# EAGLE design PulseInOut (EAGLE 6.2)
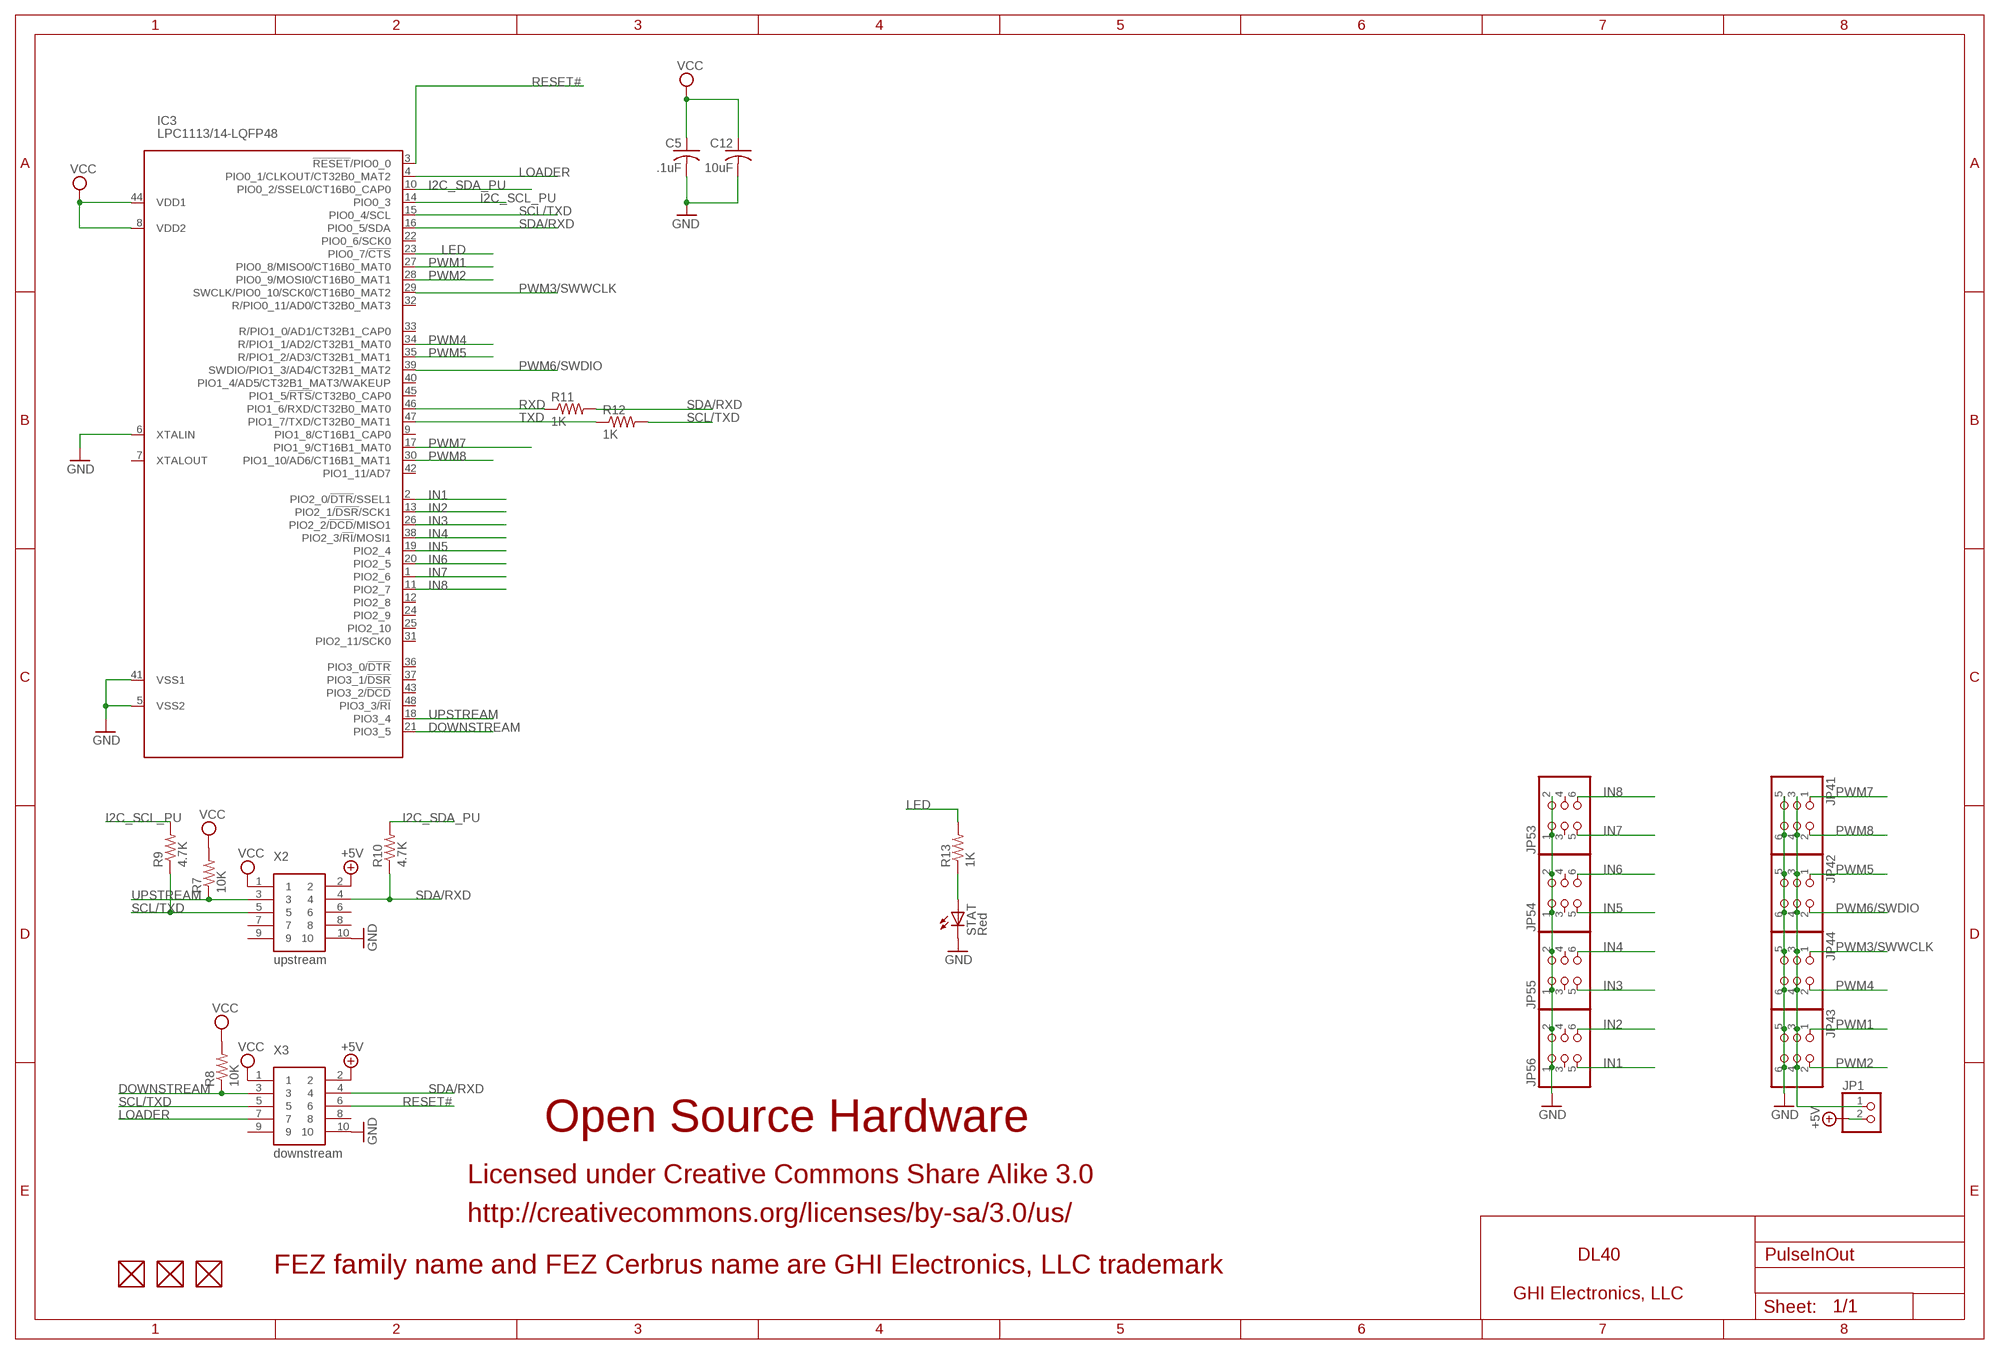
[diagram p0: schematic, sheet 1]

## Parts
C5  .1uF  C-USC0603K  [C0603K]
C12  10uF  C-USC0805K  [C0805K]
FUD4  FIDUCIAL  [FIDUCIAL_40MIL]
FUD5  FIDUCIAL  [FIDUCIAL_40MIL]
FUD6  FIDUCIAL  [FIDUCIAL_40MIL]
IC3  LPC1113/14-LQFP48  [LQFP48]
JP1  PINHD-1X2  [1X02]
JP41  PINHD-2X3  [2X03]
JP42  PINHD-2X3  [2X03]
JP43  PINHD-2X3  [2X03]
JP44  PINHD-2X3  [2X03]
JP53  PINHD-2X3  [2X03]
JP54  PINHD-2X3  [2X03]
JP55  PINHD-2X3  [2X03]
JP56  PINHD-2X3  [2X03]
R7  10K  R-US_R0603  [R0603]
R8  10K  R-US_R0603  [R0603]
R9  4.7K  R-US_R0603  [R0603]
R10  4.7K  R-US_R0603  [R0603]
R11  1K  R-US_R0603  [R0603]
R12  1K  R-US_R0603  [R0603]
R13  1K  R-US_R0603  [R0603]
STAT  Red  LEDCHIPLED_0805  [CHIPLED_0805]
X2  upstream  2X5_1.27MM  [2X5_1.27MM]
X3  downstream  2X5_1.27MM  [2X5_1.27MM]

## Nets
+5V: JP1.2 X2.2 X3.2
DOWNSTREAM: IC3.21(PIO3_5) R8.1 X3.3
GND [power]: C5.2 C12.2 IC3.5(VSS2) IC3.6(XTALIN) IC3.41(VSS1) JP41.5 JP41.6 JP42.5 JP42.6 JP43.5 JP43.6 JP44.5 JP44.6 JP53.1 JP53.2 JP54.1 JP54.2 JP55.1 JP55.2 JP56.1 JP56.2 STAT.C X2.10 X3.10
I2C_SCL_PU: IC3.14(PIO0_3) R9.2
I2C_SDA_PU: IC3.10(PIO0_2/SSEL0/CT16B0_CAP0) R10.2
IN1: IC3.2(PIO2_0/!DTR!/SSEL1) JP56.5
IN2: IC3.13(PIO2_1/!DSR!/SCK1) JP56.6
IN3: IC3.26(PIO2_2/!DCD!/MISO1) JP55.5
IN4: IC3.38(PIO2_3/!RI!/MOSI1) JP55.6
IN5: IC3.19(PIO2_4) JP54.5
IN6: IC3.20(PIO2_5) JP54.6
IN7: IC3.1(PIO2_6) JP53.5
IN8: IC3.11(PIO2_7) JP53.6
LED: IC3.23(PIO0_7/!CTS!) R13.2
LOADER: IC3.4(PIO0_1/CLKOUT/CT32B0_MAT2) X3.7
N$3: JP1.1 JP41.3 JP41.4 JP42.3 JP42.4 JP43.3 JP43.4 JP44.3 JP44.4
N$10: R13.1 STAT.A
PWM1: IC3.27(PIO0_8/MISO0/CT16B0_MAT0) JP43.1
PWM2: IC3.28(PIO0_9/MOSI0/CT16B0_MAT1) JP43.2
PWM3/SWWCLK: IC3.29(SWCLK/PIO0_10/SCK0/CT16B0_MAT2) JP44.1
PWM4: IC3.34(R/PIO1_1/AD2/CT32B1_MAT0) JP44.2
PWM5: IC3.35(R/PIO1_2/AD3/CT32B1_MAT1) JP42.1
PWM6/SWDIO: IC3.39(SWDIO/PIO1_3/AD4/CT32B1_MAT2) JP42.2
PWM7: IC3.17(PIO1_9/CT16B1_MAT0) JP41.1
PWM8: IC3.30(PIO1_10/AD6/CT16B1_MAT1) JP41.2
RESET#: IC3.3(!RESET!/PIO0_0) X3.6
RXD: IC3.46(PIO1_6/RXD/CT32B0_MAT0) R11.1
SCL/TXD: IC3.15(PIO0_4/SCL) R9.1 R12.2 X2.5 X3.5
SDA/RXD: IC3.16(PIO0_5/SDA) R10.1 R11.2 X2.4 X3.4
TXD: IC3.47(PIO1_7/TXD/CT32B0_MAT1) R12.1
UPSTREAM: IC3.18(PIO3_4) R7.1 X2.3
VCC [power]: C5.1 C12.1 IC3.8(VDD2) IC3.44(VDD1) R7.2 R8.2 X2.1 X3.1
Unconnected: FUD4.P$1 FUD5.P$1 FUD6.P$1 IC3.7(XTALOUT) IC3.9(PIO1_8/CT16B1_CAP0) IC3.12(PIO2_8) IC3.22(PIO0_6/SCK0) IC3.24(PIO2_9) IC3.25(PIO2_10) IC3.31(PIO2_11/SCK0) IC3.32(R/PIO0_11/AD0/CT32B0_MAT3) IC3.33(R/PIO1_0/AD1/CT32B1_CAP0) IC3.36(PIO3_0/!DTR!) IC3.37(PIO3_1/!DSR!) IC3.40(PIO1_4/AD5/CT32B1_MAT3/WAKEUP) IC3.42(PIO1_11/AD7) IC3.43(PIO3_2/!DCD!) IC3.45(PIO1_5/!RTS!/CT32B0_CAP0) IC3.48(PIO3_3/!RI!) JP53.3 JP53.4 JP54.3 JP54.4 JP55.3 JP55.4 JP56.3 JP56.4 X2.6 X2.7 X2.8 X2.9 X3.8 X3.9

## Notes on the sheet
- Open Source Hardware
- Licensed under Creative Commons Share Alike 3.0
- http://creativecommons.org/licenses/by-sa/3.0/us/
- DL40
- FEZ family name and FEZ Cerbrus name are GHI Electronics, LLC trademark
- GHI Electronics, LLC

## Library data of the parts
C5 C12 = rcl:C-US: CAPACITOR, American symbol
FUD4-FUD6 = GHI:FIDUCIAL
IC3 = lpc1100v1.1:LPC1113/14-LQFP48: NXP Semiconductors LPC11xx microcontrollers <http://ics.nxp.com/products/lpc1000/lpc11xx/> ARM 32-bit Cortex-M0 Microcontroller with MPU CPU clock up to 50MHz Up to 32KByte on-chip Flash ROM with In-System Programming (ISP) and In-Application Programming (IAP) via On-Chip Bootloader Up to 8KByte SRAM Nested Vectored Interrupt Controller Up to 2 SPI controllers UART with full Modem Interface and RS485 Support Fast Mode I2C-Bus 4 Timers with 4 capture channels and 13 output channels Watchdog (WDT) Sytem tick timer 10-bit ADC with 8 channels Power Management Unit (PMU) Brownout detection 12MHz internal RC oscillator Serial Wire Debug/Trace port
JP1 = pinhead:PINHD-1X2: PIN HEADER
JP41-JP44 JP53-JP56 = pinhead:PINHD-2X3: PIN HEADER
R7-R13 = rcl:R-US_: RESISTOR, American symbol
STAT = led:LED: LED OSRAM: - CHIPLED LG R971, LG N971, LY N971, LG Q971, LY Q971, LO R971, LY R971 LH N974, LH R974 LS Q976, LO Q976, LY Q976 LO Q996 - Hyper CHIPLED LW Q18S LB Q993, LB Q99A, LB R99A - SideLED LS A670, LO A670, LY A670, LG A670, LP A670 LB A673, LV A673, LT A673, LW A673 LH A674 LY A675 LS A676, LA A676, LO A676, LY A676, LW A676 LS A679, LY A679, LG A679 - Hyper Micro SIDELED® LS Y876, LA Y876, LO Y876, LY Y876 LT Y87S - SmartLED LW L88C, LW L88S LB L89C, LB L89S, LG L890 LS L89K, LO L89K, LY L89K LS L896, LA L896, LO L896, LY L896 - TOPLED LS T670, LO T670, LY T670, LG T670, LP T670 LSG T670, LSP T670, LSY T670, LOP T670, LYG T670 LG T671, LOG T671, LSG T671 LB T673, LV T673, LT T673, LW T673 LH T674 LS T676, LA T676, LO T676, LY T676, LB T676, LH T676, LSB T676, LW T676 LB T67C, LV T67C, LT T67C, LS T67K, LO T67K, LY T67K, LW E67C LS E67B, LA E67B, LO E67B, LY E67B, LB E67C, LV E67C, LT E67C LW T67C LS T679, LY T679, LG T679 LS T770, LO T770, LY T770, LG T770, LP T770 LB T773, LV T773, LT T773, LW T773 LH T774 LS E675, LA E675, LY E675, LS T675 LS T776, LA T776, LO T776, LY T776, LB T776 LHGB T686 LT T68C, LB T68C - Hyper Mini TOPLED® LB M676 - Mini TOPLED Santana® LG M470 LS M47K, LO M47K, LY M47K Source: http://www.osram.convergy.de LUXEON: - LUMILED® LXK2-PW12-R00, LXK2-PW12-S00, LXK2-PW14-U00, LXK2-PW14-V00 LXK2-PM12-R00, LXK2-PM12-S00, LXK2-PM14-U00 LXK2-PE12-Q00, LXK2-PE12-R00, LXK2-PE12-S00, LXK2-PE14-T00, LXK2-PE14-U00 LXK2-PB12-K00, LXK2-PB12-L00, LXK2-PB12-M00, LXK2-PB14-N00, LXK2-PB14-P00, LXK2-PB14-Q00 LXK2-PR12-L00, LXK2-PR12-M00, LXK2-PR14-Q00, LXK2-PR14-R00 LXK2-PD12-Q00, LXK2-PD12-R00, LXK2-PD12-S00 LXK2-PH12-R00, LXK2-PH12-S00 LXK2-PL12-P00, LXK2-PL12-Q00, LXK2-PL12-R00 Source: www.luxeon.com KINGBRIGHT: KA-3528ASYC Source: www.kingbright.com
X2 X3 = GHI:2X5_1.27MM

## Board
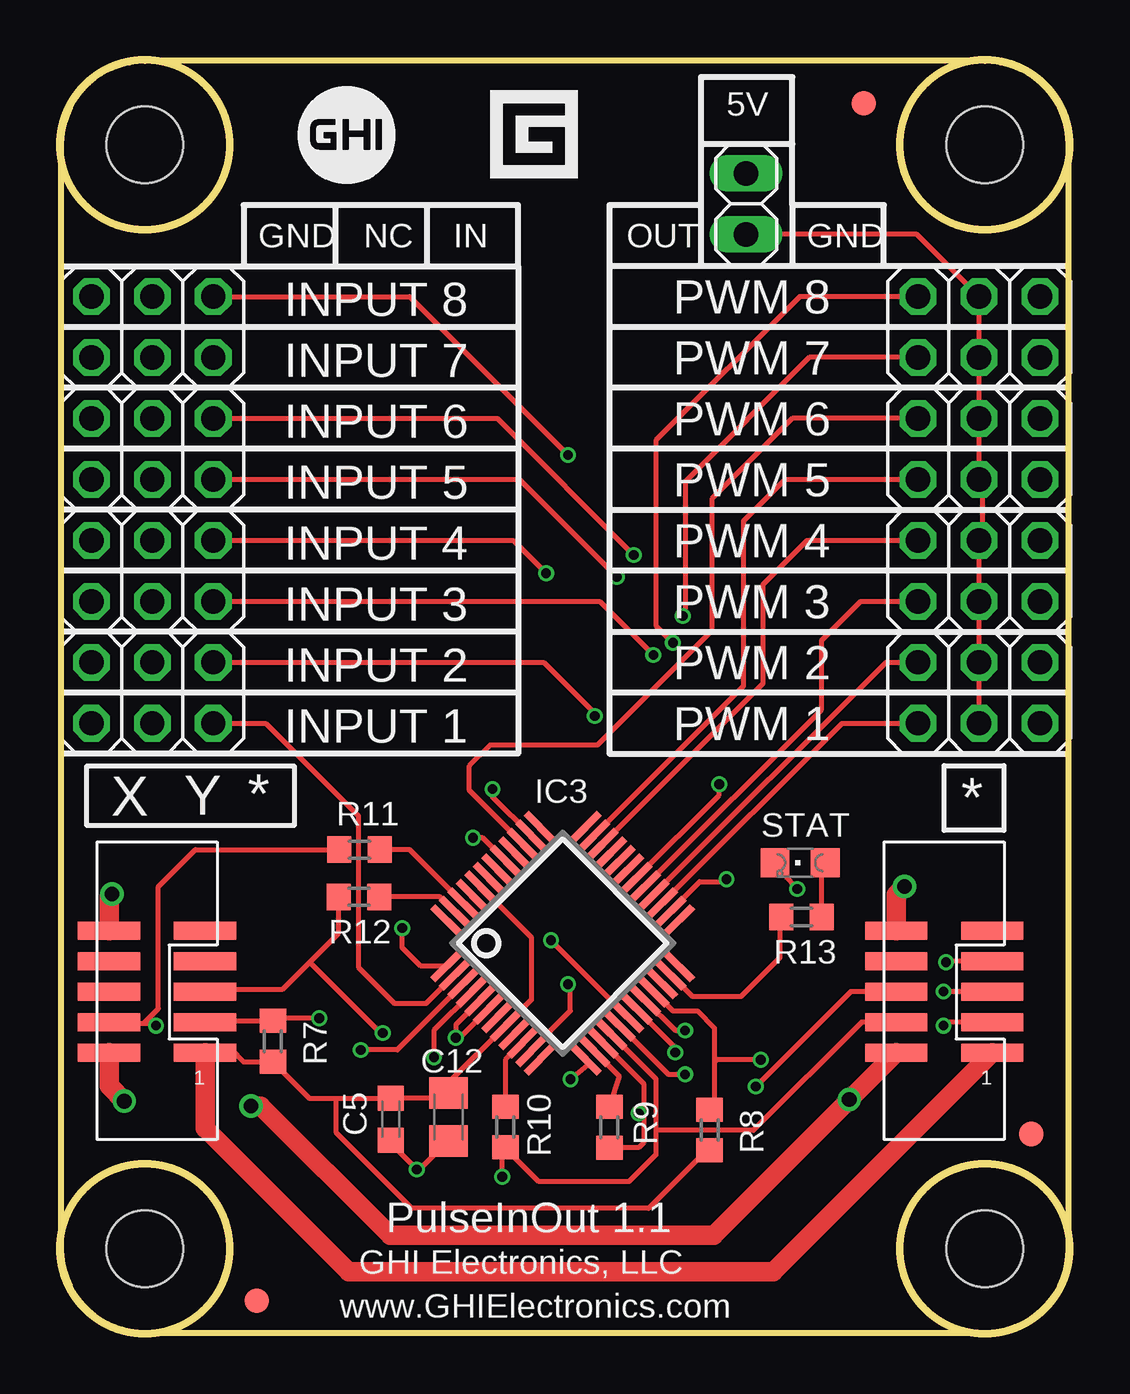
[diagram p1: board, top side]
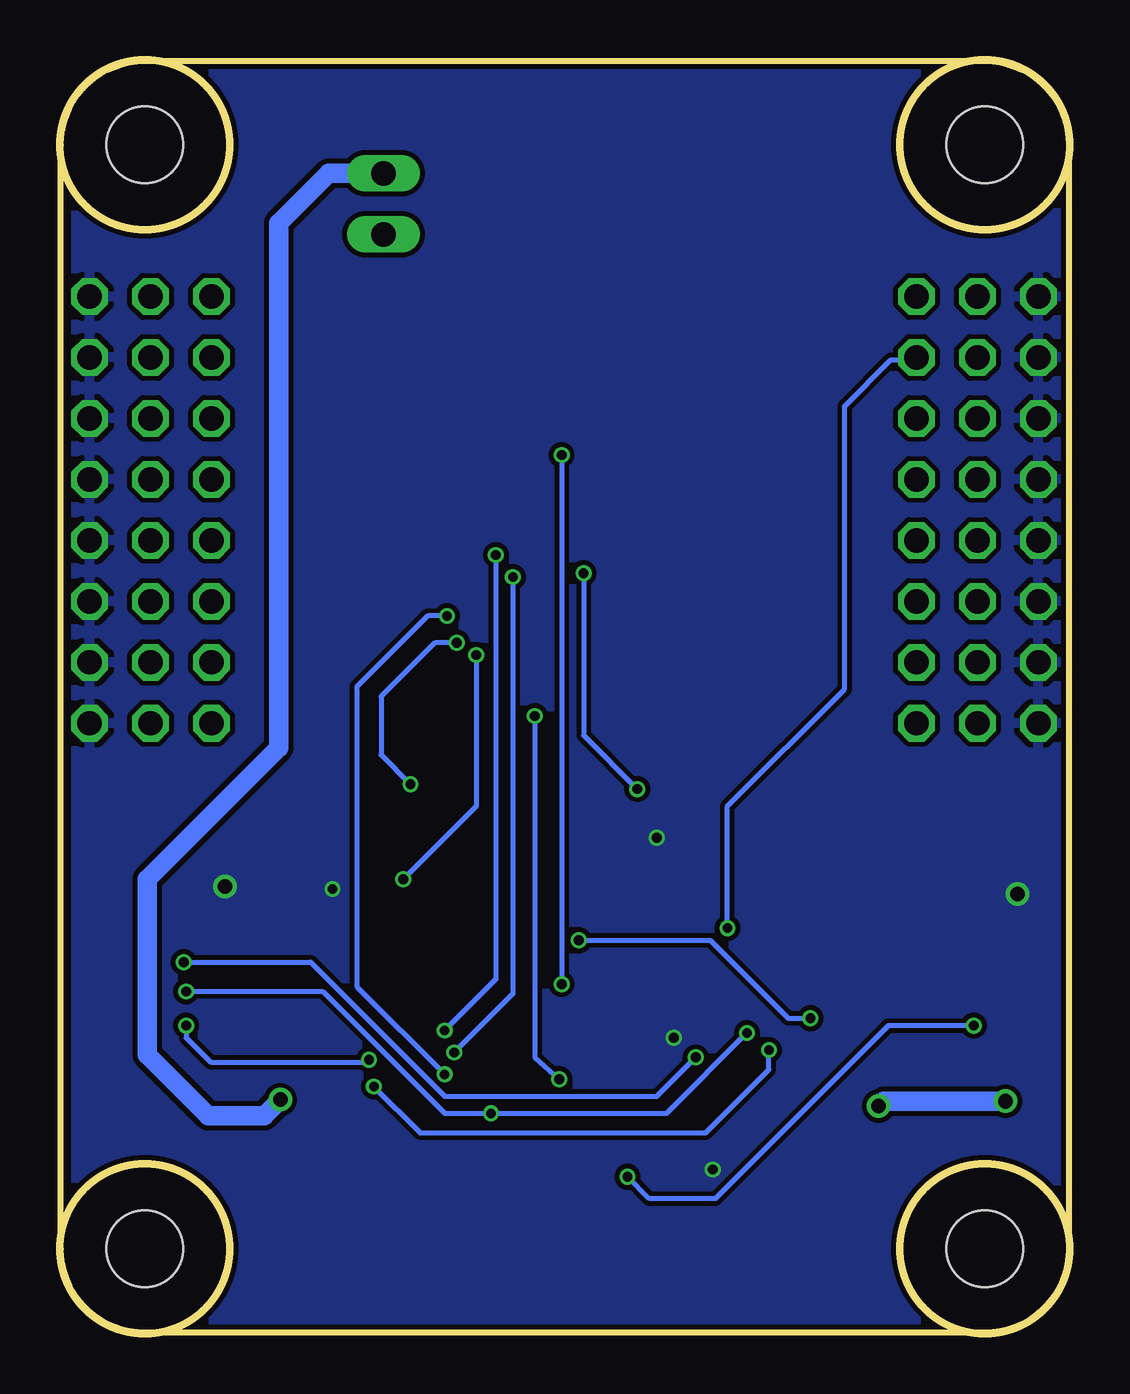
[diagram p2: board, bottom side, seen from below]

Size 42.07 x 53.07 mm. Coordinates in mm from the lower left corner, seen from the top.
Outline: 38.54,0.04 arc90 42.04,3.54 42.04,49.54 arc90 38.54,53.04 3.54,53.04 arc90 0.04,49.54 0.04,3.54 arc90 3.54,0.04 38.54,0.04
Outline: circle at 38.54,3.54 radius 3.54
Outline: circle at 3.54,3.54 radius 3.54
Outline: circle at 3.54,49.54 radius 3.54
Outline: circle at 38.54,49.54 radius 3.54
Copper layers (1+16): Top 0.035mm / dielectric 1.5mm / Bottom 0.035mm
Design rules: minimum track width 6mil, minimum drill 10mil, track to track 8mil, track to pad 8mil, pad to pad 7.5mil, via to via 8mil, smd to smd 7.5mil, copper to edge 8mil, drill to drill 8mil, minimum pad ring 10mil, minimum via ring 5mil, stop-mask expansion 4mil, vias tented up to drill 50mil, thermal gap 10mil
Holes 3.2 mm at 3.54,3.54 38.54,3.54 3.54,49.54 38.54,49.54

### Footprints (pad centres in the part's own frame; a part is rotated, then mirrored left to right if it is on the bottom)
C0603K = smd 1.05 x 1.08: 1 -0.875,0; 2 0.875,0
C0805K = smd 1.3 x 1.6: 1 -1,0; 2 1,0
FIDUCIAL_40MIL = smd 1.016 x 1.016: P$1 0,0
LQFP48 = smd 0.3 x 1.6: 1 -2.75,-4.1; 2 -2.25,-4.1; 3 -1.75,-4.1; 4 -1.25,-4.1; 5 -0.75,-4.1; 6 -0.25,-4.1; 7 0.25,-4.1; 8 0.75,-4.1; 9 1.25,-4.1; 10 1.75,-4.1; 11 2.25,-4.1; 12 2.75,-4.1; 25 2.75,4.1; 26 2.25,4.1; 27 1.75,4.1; 28 1.25,4.1; 29 0.75,4.1; 30 0.25,4.1; 31 -0.25,4.1; 32 -0.75,4.1; 33 -1.25,4.1; 34 -1.75,4.1; 35 -2.25,4.1; 36 -2.75,4.1 | smd 1.6 x 0.3: 13 4.1,-2.75; 14 4.1,-2.25; 15 4.1,-1.75; 16 4.1,-1.25; 17 4.1,-0.75; 18 4.1,-0.25; 19 4.1,0.25; 20 4.1,0.75; 21 4.1,1.25; 22 4.1,1.75; 23 4.1,2.25; 24 4.1,2.75; 37 -4.1,2.75; 38 -4.1,2.25; 39 -4.1,1.75; 40 -4.1,1.25; 41 -4.1,0.75; 42 -4.1,0.25; 43 -4.1,-0.25; 44 -4.1,-0.75; 45 -4.1,-1.25; 46 -4.1,-1.75; 47 -4.1,-2.25; 48 -4.1,-2.75
1X02 = drill 1.016 long: 1 -1.27,0; 2 1.27,0
2X03 = drill 1.016 octagon: 1 -2.54,-1.27; 2 -2.54,1.27; 3 0,-1.27; 4 0,1.27; 5 2.54,-1.27; 6 2.54,1.27
R0603 = smd 1 x 1.1: 1 -0.85,0; 2 0.85,0
CHIPLED_0805 = smd 1.2 x 1.2: A 0,-1.05; C 0,1.05
2X5_1.27MM = smd 2.6 x 0.74: 1 -2,2.58; 2 2,2.58; 3 -2,1.31; 4 2,1.31; 5 -2,0.04; 6 2,0.04; 7 -2,-1.23; 8 2,-1.23; 9 -2,-2.5; 10 2,-2.5

### Placement (x,y rotation side)
C5  13.78,8.93 270 top
C12  16.18,9.03 270 top
FUD4  40.47,8.32 0 top
FUD5  33.49,51.27 0 top
FUD6  8.19,1.38 0 top
IC3  20.94,16.27 315 top
JP1  28.59,47.08 90 top
JP41  38.3,41.95 0 top
JP42  38.3,36.87 0 top
JP43  38.3,26.71 0 top
JP44  38.3,31.79 0 top
JP53  3.85,41.95 0 top
JP54  3.85,36.87 0 top
JP55  3.85,31.79 0 top
JP56  3.85,26.71 0 top
R7  8.87,12.18 270 top
R8  27.07,8.49 270 top
R9  22.89,8.6 90 top
R10  18.56,8.62 90 top
R11  12.48,20.17 180 top
R12  12.46,18.2 180 top
R13  30.9,17.36 180 top
STAT  30.84,19.62 90 top
X2  4.04,14.29 180 top
X3  36.84,14.29 180 top

### Tracks (layer width: path | path; a pad name or v marks a point on that pad's centre or on a via)
+5V  (via drill 0.61)
  Top 0.813: X3.2 v32.89,9.75 27.23,4.1 13.75,4.1 8.37,9.48 v7.96,9.48 | v2.68,9.69 2.04,10.32 X2.2
  Bottom 0.813: v7.96,9.48 7.76,9.69 v2.68,9.69 | JP1.2 30.87,48.35 32.95,46.26 32.95,24.42 38.44,18.93 38.44,11.62 35.9,9.08 33.56,9.08 v32.89,9.75
DOWNSTREAM  (via drill 0.41)
  Top 0.203: IC3.21 25.54,13.45 26.55,13.45 27.26,12.74 27.26,11.31 | 27.26,11.31 27.26,9.54 R8.1 | X3.3 36.96,12.98 v36.81,12.84 | v29.19,11.41 27.37,11.41 27.26,11.31
  Bottom 0.203: v36.81,12.84 36.81,12.33 35.8,11.31 29.3,11.31 v29.19,11.41
GND  (via drill 0.41, 0.61)
  Top 0.203: IC3.41 17.61,20.66 v17.21,20.66 | IC3.6 16.65,12.33 v16.49,12.33 16.49,12.88 IC3.5 | C12.2 15,6.84 v14.87,6.84 13.78,7.93 C5.2 | STAT.C 29.79,19.56 v30.72,18.53
  Top 0.813: X2.10 2.04,18.2 v2.17,18.32 | X3.10 34.84,18.28 v35.19,18.63
  pour Bottom: 0.14,52.97 0.14,-0.37 41.39,-0.37 41.39,52.97
I2C_SCL_PU
  Top 0.203: IC3.14 23.3,10.73 R9.2
I2C_SDA_PU
  Top 0.203: IC3.10 18.56,11.41 R10.2
IN1
  Top 0.203: JP56.5 8.57,25.44 12.43,21.57 12.43,15.28 13.95,13.75 15.24,13.75 IC3.2
IN2  (via drill 0.41)
  Top 0.203: JP56.6 20.15,27.98 22.29,25.84 v22.29,25.74 | v21.27,10.6 21.98,11.21 21.98,11.34 IC3.13
  Bottom 0.203: v22.29,25.74 22.29,11.52 v21.27,10.6
IN3  (via drill 0.41)
  Top 0.203: IC3.26 25.43,17.61 26.65,18.83 27.67,18.83 v27.77,18.93 | JP55.5 22.49,30.52 v24.72,28.28
  Bottom 0.203: v24.72,28.28 24.72,21.98 v27.77,18.93
IN4  (via drill 0.41)
  Top 0.203: JP55.6 18.88,33.06 v20.25,31.68 | IC3.38 18.02,22.38 v18.02,22.69
  Bottom 0.203: v20.25,31.68 20.25,24.93 v18.02,22.69
IN5  (via drill 0.41)
  Top 0.203: JP54.5 19.14,35.6 v23.2,31.53 | IC3.19 25.64,11.92 v25.64,11.72
  Bottom 0.203: v23.2,31.53 23.2,14.16 v25.64,11.72
IN6  (via drill 0.41)
  Top 0.203: JP54.6 18.22,38.14 v23.91,32.45 | IC3.20 25.64,12.63 v26.05,12.63
  Bottom 0.203: v23.91,32.45 23.91,14.77 v26.05,12.63
IN7  (via drill 0.41)
  Top 0.203: IC3.1 15.03,15.31 14.26,16.09 v14.26,16.9
  Bottom 0.203: v14.26,16.9 14.26,21.98 9.38,26.86 9.38,38.64 7.45,40.57 6.49,40.57 JP53.5
IN8  (via drill 0.41)
  Top 0.203: JP53.6 14.56,43.22 v21.17,36.61 | IC3.11 19.64,11.81 21.27,13.45 21.27,14.46 v21.17,14.56
  Bottom 0.203: v21.17,36.61 v21.17,14.56
LED
  Top 0.203: IC3.23 26.35,14.06 28.38,14.06 30.01,15.68 30.01,17.32 R13.2
LOADER  (via drill 0.41)
  Top 0.203: X3.7 36.96,15.52 v36.92,15.48 | IC3.4 17.16,14.22 15.58,12.63 v15.58,11.52
  Bottom 0.203: v36.92,15.48 31.63,15.48 26.05,9.89 17.21,9.89 v15.58,11.52
N$3
  Top 0.203: JP43.3 JP43.4 JP44.3 JP44.4 38.44,33.2 38.44,35.7 | 38.44,35.7 38.44,36.1 38.3,36.25 JP42.4 JP41.3 JP41.4 35.7,45.81 JP1.1 | JP42.3 38.4,35.7 38.44,35.7
N$10
  Top 0.203: R13.1 31.75,19.48 STAT.A
PWM1
  Top 0.203: IC3.27 32.59,25.44 JP43.1
PWM2
  Top 0.203: IC3.28 34.42,27.98 JP43.2
PWM3/SWWCLK
  Top 0.203: IC3.29 31.73,26 31.73,28.89 33.36,30.52 JP44.1
PWM4
  Top 0.203: IC3.34 29.3,27.1 29.3,31.23 31.13,33.06 JP44.2
PWM5
  Top 0.203: IC3.35 28.48,26.99 28.48,33.87 30.21,35.6 JP42.1
PWM6/SWDIO
  Top 0.203: JP42.2 30.52,38.14 27.16,34.78 27.16,29.3 22.39,24.52 17.92,24.52 17.05,23.66 17.05,22.63 IC3.39
PWM7  (via drill 0.41)
  Top 0.203: JP41.1 31.23,40.68 26.05,35.49 26.05,30.01 v25.94,29.91 | IC3.17 25.35,10.81 v26.05,10.81
  Bottom 0.203: v25.94,29.91 26.76,29.91 29.7,26.96 29.7,14.46 v26.05,10.81
PWM8  (via drill 0.41)
  Top 0.203: JP41.2 30.82,43.22 24.83,37.22 24.83,29.5 v25.54,28.79 | IC3.30 27.47,22.44 v27.47,22.9
  Bottom 0.203: v25.54,28.79 26.45,28.79 28.69,26.55 28.69,24.11 v27.47,22.9
RESET#  (via drill 0.41)
  Top 0.203: X3.6 32.94,14.25 v28.99,10.3 | IC3.3 16.81,14.57 14.06,11.82 v12.53,11.82
  Bottom 0.203: v28.99,10.3 27.06,8.37 15.17,8.37 12.53,11.01 v12.53,11.82
RXD
  Top 0.203: IC3.46 14.57,20.17 R11.1
SCL/TXD  (via drill 0.41)
  Top 0.203: IC3.15 24.32,10.42 24.32,9.48 | 24.32,9.48 24.32,7.96 24.11,7.75 R9.1 | X2.5 6.16,14.36 9.28,14.36 10.4,15.48 | 10.4,15.48 11.61,16.69 R12.2 | X3.5 v36.82,14.25 v36.81,14.26 | 24.32,9.48 v24.11,9.18 | v13.45,12.53 13.35,12.53 10.4,15.48
  Bottom 0.203: v36.81,14.26 31.13,14.26 26.05,9.18 v24.11,9.18 16.8,9.18 v13.45,12.53
SDA/RXD  (via drill 0.41)
  Top 0.203: IC3.16 24.83,10.62 24.83,8.47 | 24.83,8.47 24.83,7.45 23.71,6.33 19.95,6.33 18.56,7.73 R10.1 18.43,7.63 v18.43,6.54 | X2.4 2.08,12.94 3.49,12.94 | 3.49,12.94 4.1,13.55 4.1,18.63 5.64,20.17 R11.2 | X3.4 33.4,12.98 28.89,8.47 24.83,8.47 | 3.49,12.94 3.9,12.94 v4,12.84
  Bottom 0.203: v4,12.84 7.55,12.84 14.77,5.62 17.51,5.62 v18.43,6.54
TXD
  Top 0.203: IC3.47 15.83,18.2 R12.1
UPSTREAM  (via drill 0.41)
  Top 0.203: X2.3 6.1,13.03 R7.1 8.98,13.14 v10.81,13.14 | IC3.18 v20.46,16.39
  Bottom 0.203: v20.46,16.39 14.97,16.39 11.72,13.14 v10.81,13.14
VCC
  Top 0.203: IC3.44 19.64,16.51 19.64,13.91 IC3.8 16.18,10.45 C12.1 15.96,9.81 C5.1 11.52,9.81 | X2.1 6.16,11.82 7.15,11.82 7.64,11.33 R7.2 10.4,9.81 11.52,9.81 | R8.2 26.95,7.64 24.52,5.22 14.67,5.22 11.52,8.37 11.52,9.81
  Top 0.813: X3.1 29.71,2.58 12.02,2.58 6.04,8.56 X2.1

### Text on the board
tPlace: 5V | GND | NC | IN | OUT | GND | INPUT 8 | PWM 8 | INPUT 7 | PWM 7 | INPUT 6 | PWM 6 | INPUT 5 | PWM 5 | INPUT 4 | PWM 4 | INPUT 3 | PWM 3 | INPUT 2 | PWM 2 | INPUT 1 | PWM 1 | X | Y | * | * | PulseInOut 1.1 | GHI Electronics, LLC | www.GHIElectronics.com